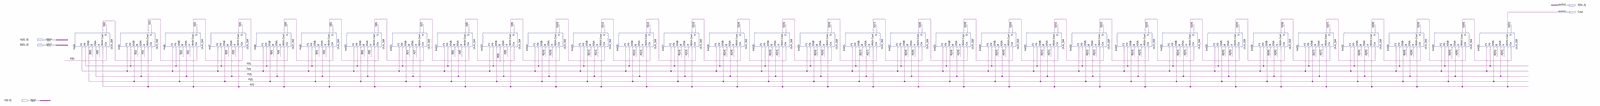
[diagram p0: schematic sheet, whole]
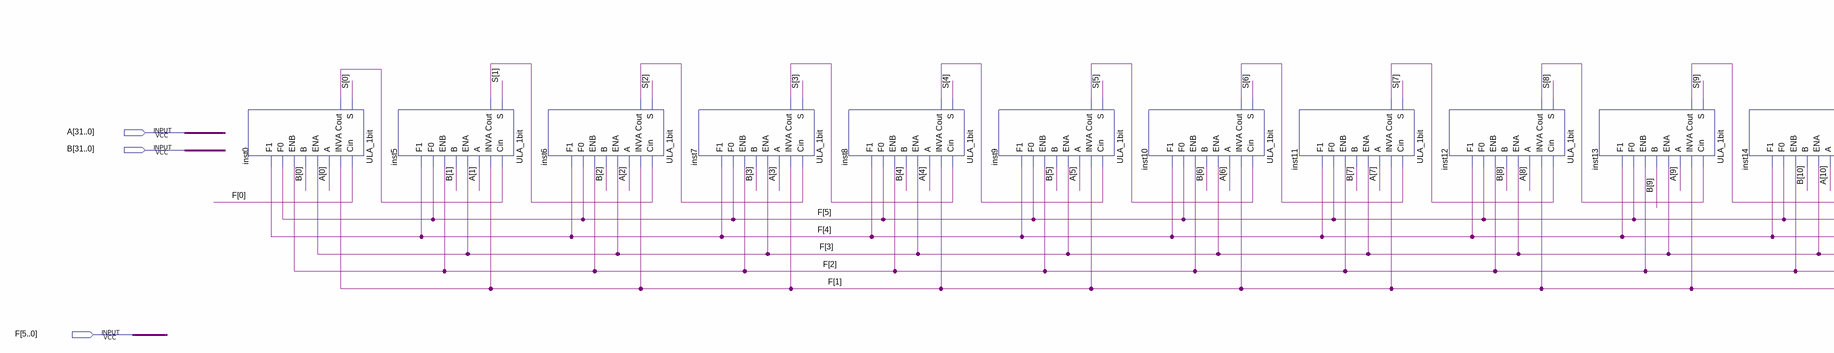
[diagram p1: schematic sheet, left part]
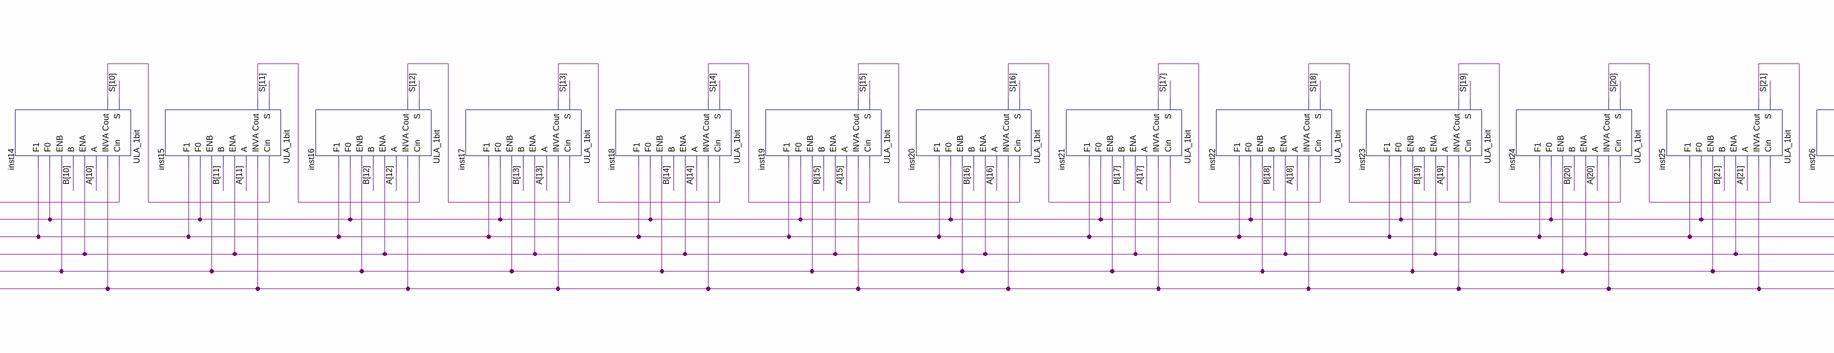
[diagram p2: schematic sheet, centre part]
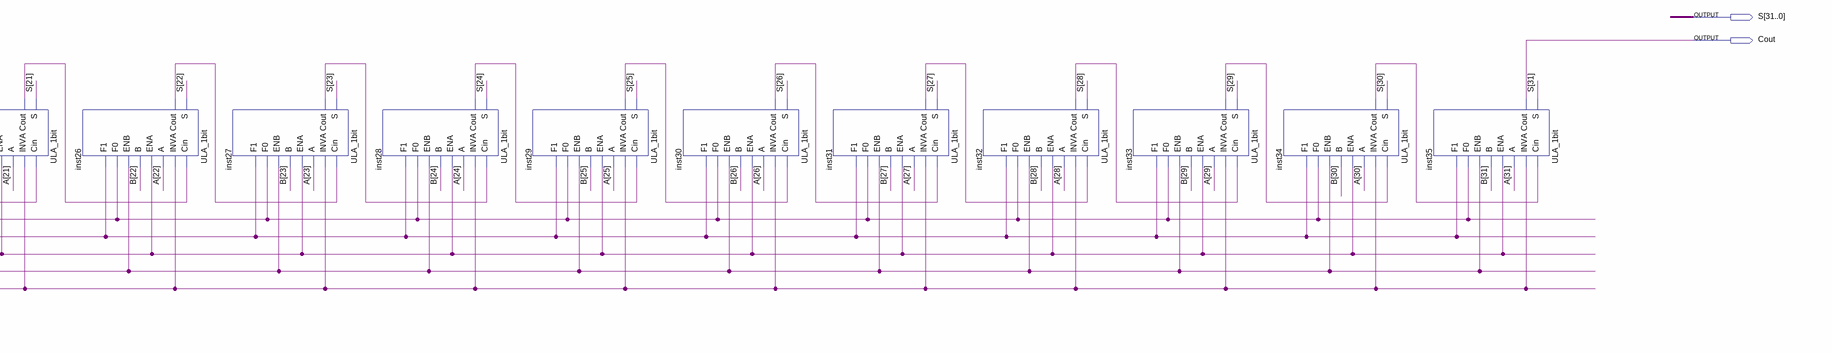
[diagram p3: schematic sheet, right part]
// Quartus schematic ULA_32bit.bdf as structural Verilog: 32 symbols, 5 pins
module ULA_32bit (
  input  [31:0] A,
  input  [31:0] B,
  input  [5:0] F,
  output [31:0] S,
  output Cout
);

  wire inst0_cout, inst5_cout, inst6_cout, inst7_cout, inst8_cout, inst9_cout, inst10_cout, inst11_cout,
       inst12_cout, inst13_cout, inst14_cout, inst15_cout, inst16_cout, inst17_cout, inst18_cout,
       inst19_cout, inst20_cout, inst21_cout, inst22_cout, inst23_cout, inst24_cout, inst25_cout,
       inst26_cout, inst27_cout, inst28_cout, inst29_cout, inst30_cout, inst31_cout, inst32_cout,
       inst33_cout, inst34_cout;

  ULA_1bit inst0 (
    .Cin(F[0]), .INVA(F[1]), .A(A[0]), .ENA(F[3]), .B(B[0]), .ENB(F[2]), .F0(F[5]), .F1(F[4]), .S(S[0]),
    .Cout(inst0_cout));
  ULA_1bit inst5 (
    .Cin(inst0_cout), .INVA(F[1]), .A(A[1]), .ENA(F[3]), .B(B[1]), .ENB(F[2]), .F0(F[5]), .F1(F[4]),
    .S(S[1]), .Cout(inst5_cout));
  ULA_1bit inst6 (
    .Cin(inst5_cout), .INVA(F[1]), .A(A[2]), .ENA(F[3]), .B(B[2]), .ENB(F[2]), .F0(F[5]), .F1(F[4]),
    .S(S[2]), .Cout(inst6_cout));
  ULA_1bit inst7 (
    .Cin(inst6_cout), .INVA(F[1]), .A(A[3]), .ENA(F[3]), .B(B[3]), .ENB(F[2]), .F0(F[5]), .F1(F[4]),
    .S(S[3]), .Cout(inst7_cout));
  ULA_1bit inst8 (
    .Cin(inst7_cout), .INVA(F[1]), .A(A[4]), .ENA(F[3]), .B(B[4]), .ENB(F[2]), .F0(F[5]), .F1(F[4]),
    .S(S[4]), .Cout(inst8_cout));
  ULA_1bit inst9 (
    .Cin(inst8_cout), .INVA(F[1]), .A(A[5]), .ENA(F[3]), .B(B[5]), .ENB(F[2]), .F0(F[5]), .F1(F[4]),
    .S(S[5]), .Cout(inst9_cout));
  ULA_1bit inst10 (
    .Cin(inst9_cout), .INVA(F[1]), .A(A[6]), .ENA(F[3]), .B(B[6]), .ENB(F[2]), .F0(F[5]), .F1(F[4]),
    .S(S[6]), .Cout(inst10_cout));
  ULA_1bit inst11 (
    .Cin(inst10_cout), .INVA(F[1]), .A(A[7]), .ENA(F[3]), .B(B[7]), .ENB(F[2]), .F0(F[5]), .F1(F[4]),
    .S(S[7]), .Cout(inst11_cout));
  ULA_1bit inst12 (
    .Cin(inst11_cout), .INVA(F[1]), .A(A[8]), .ENA(F[3]), .B(B[8]), .ENB(F[2]), .F0(F[5]), .F1(F[4]),
    .S(S[8]), .Cout(inst12_cout));
  ULA_1bit inst13 (
    .Cin(inst12_cout), .INVA(F[1]), .A(A[9]), .ENA(F[3]), .B(B[9]), .ENB(F[2]), .F0(F[5]), .F1(F[4]),
    .S(S[9]), .Cout(inst13_cout));
  ULA_1bit inst14 (
    .Cin(inst13_cout), .INVA(F[1]), .A(A[10]), .ENA(F[3]), .B(B[10]), .ENB(F[2]), .F0(F[5]), .F1(F[4]),
    .S(S[10]), .Cout(inst14_cout));
  ULA_1bit inst15 (
    .Cin(inst14_cout), .INVA(F[1]), .A(A[11]), .ENA(F[3]), .B(B[11]), .ENB(F[2]), .F0(F[5]), .F1(F[4]),
    .S(S[11]), .Cout(inst15_cout));
  ULA_1bit inst16 (
    .Cin(inst15_cout), .INVA(F[1]), .A(A[12]), .ENA(F[3]), .B(B[12]), .ENB(F[2]), .F0(F[5]), .F1(F[4]),
    .S(S[12]), .Cout(inst16_cout));
  ULA_1bit inst17 (
    .Cin(inst16_cout), .INVA(F[1]), .A(A[13]), .ENA(F[3]), .B(B[13]), .ENB(F[2]), .F0(F[5]), .F1(F[4]),
    .S(S[13]), .Cout(inst17_cout));
  ULA_1bit inst18 (
    .Cin(inst17_cout), .INVA(F[1]), .A(A[14]), .ENA(F[3]), .B(B[14]), .ENB(F[2]), .F0(F[5]), .F1(F[4]),
    .S(S[14]), .Cout(inst18_cout));
  ULA_1bit inst19 (
    .Cin(inst18_cout), .INVA(F[1]), .A(A[15]), .ENA(F[3]), .B(B[15]), .ENB(F[2]), .F0(F[5]), .F1(F[4]),
    .S(S[15]), .Cout(inst19_cout));
  ULA_1bit inst20 (
    .Cin(inst19_cout), .INVA(F[1]), .A(A[16]), .ENA(F[3]), .B(B[16]), .ENB(F[2]), .F0(F[5]), .F1(F[4]),
    .S(S[16]), .Cout(inst20_cout));
  ULA_1bit inst21 (
    .Cin(inst20_cout), .INVA(F[1]), .A(A[17]), .ENA(F[3]), .B(B[17]), .ENB(F[2]), .F0(F[5]), .F1(F[4]),
    .S(S[17]), .Cout(inst21_cout));
  ULA_1bit inst22 (
    .Cin(inst21_cout), .INVA(F[1]), .A(A[18]), .ENA(F[3]), .B(B[18]), .ENB(F[2]), .F0(F[5]), .F1(F[4]),
    .S(S[18]), .Cout(inst22_cout));
  ULA_1bit inst23 (
    .Cin(inst22_cout), .INVA(F[1]), .A(A[19]), .ENA(F[3]), .B(B[19]), .ENB(F[2]), .F0(F[5]), .F1(F[4]),
    .S(S[19]), .Cout(inst23_cout));
  ULA_1bit inst24 (
    .Cin(inst23_cout), .INVA(F[1]), .A(A[20]), .ENA(F[3]), .B(B[20]), .ENB(F[2]), .F0(F[5]), .F1(F[4]),
    .S(S[20]), .Cout(inst24_cout));
  ULA_1bit inst25 (
    .Cin(inst24_cout), .INVA(F[1]), .A(A[21]), .ENA(F[3]), .B(B[21]), .ENB(F[2]), .F0(F[5]), .F1(F[4]),
    .S(S[21]), .Cout(inst25_cout));
  ULA_1bit inst26 (
    .Cin(inst25_cout), .INVA(F[1]), .A(A[22]), .ENA(F[3]), .B(B[22]), .ENB(F[2]), .F0(F[5]), .F1(F[4]),
    .S(S[22]), .Cout(inst26_cout));
  ULA_1bit inst27 (
    .Cin(inst26_cout), .INVA(F[1]), .A(A[23]), .ENA(F[3]), .B(B[23]), .ENB(F[2]), .F0(F[5]), .F1(F[4]),
    .S(S[23]), .Cout(inst27_cout));
  ULA_1bit inst28 (
    .Cin(inst27_cout), .INVA(F[1]), .A(A[24]), .ENA(F[3]), .B(B[24]), .ENB(F[2]), .F0(F[5]), .F1(F[4]),
    .S(S[24]), .Cout(inst28_cout));
  ULA_1bit inst29 (
    .Cin(inst28_cout), .INVA(F[1]), .A(A[25]), .ENA(F[3]), .B(B[25]), .ENB(F[2]), .F0(F[5]), .F1(F[4]),
    .S(S[25]), .Cout(inst29_cout));
  ULA_1bit inst30 (
    .Cin(inst29_cout), .INVA(F[1]), .A(A[26]), .ENA(F[3]), .B(B[26]), .ENB(F[2]), .F0(F[5]), .F1(F[4]),
    .S(S[26]), .Cout(inst30_cout));
  ULA_1bit inst31 (
    .Cin(inst30_cout), .INVA(F[1]), .A(A[27]), .ENA(F[3]), .B(B[27]), .ENB(F[2]), .F0(F[5]), .F1(F[4]),
    .S(S[27]), .Cout(inst31_cout));
  ULA_1bit inst32 (
    .Cin(inst31_cout), .INVA(F[1]), .A(A[28]), .ENA(F[3]), .B(B[28]), .ENB(F[2]), .F0(F[5]), .F1(F[4]),
    .S(S[28]), .Cout(inst32_cout));
  ULA_1bit inst33 (
    .Cin(inst32_cout), .INVA(F[1]), .A(A[29]), .ENA(F[3]), .B(B[29]), .ENB(F[2]), .F0(F[5]), .F1(F[4]),
    .S(S[29]), .Cout(inst33_cout));
  ULA_1bit inst34 (
    .Cin(inst33_cout), .INVA(F[1]), .A(A[30]), .ENA(F[3]), .B(B[30]), .ENB(F[2]), .F0(F[5]), .F1(F[4]),
    .S(S[30]), .Cout(inst34_cout));
  ULA_1bit inst35 (
    .Cin(inst34_cout), .INVA(F[1]), .A(A[31]), .ENA(F[3]), .B(B[31]), .ENB(F[2]), .F0(F[5]), .F1(F[4]),
    .S(S[31]), .Cout(Cout));
endmodule
